# Altium schematic sheet ADC.SchDoc
size Tabloid; DocumentNumber: 6; SheetNumber: 6; SheetTotal: 11; SheetName: ADC
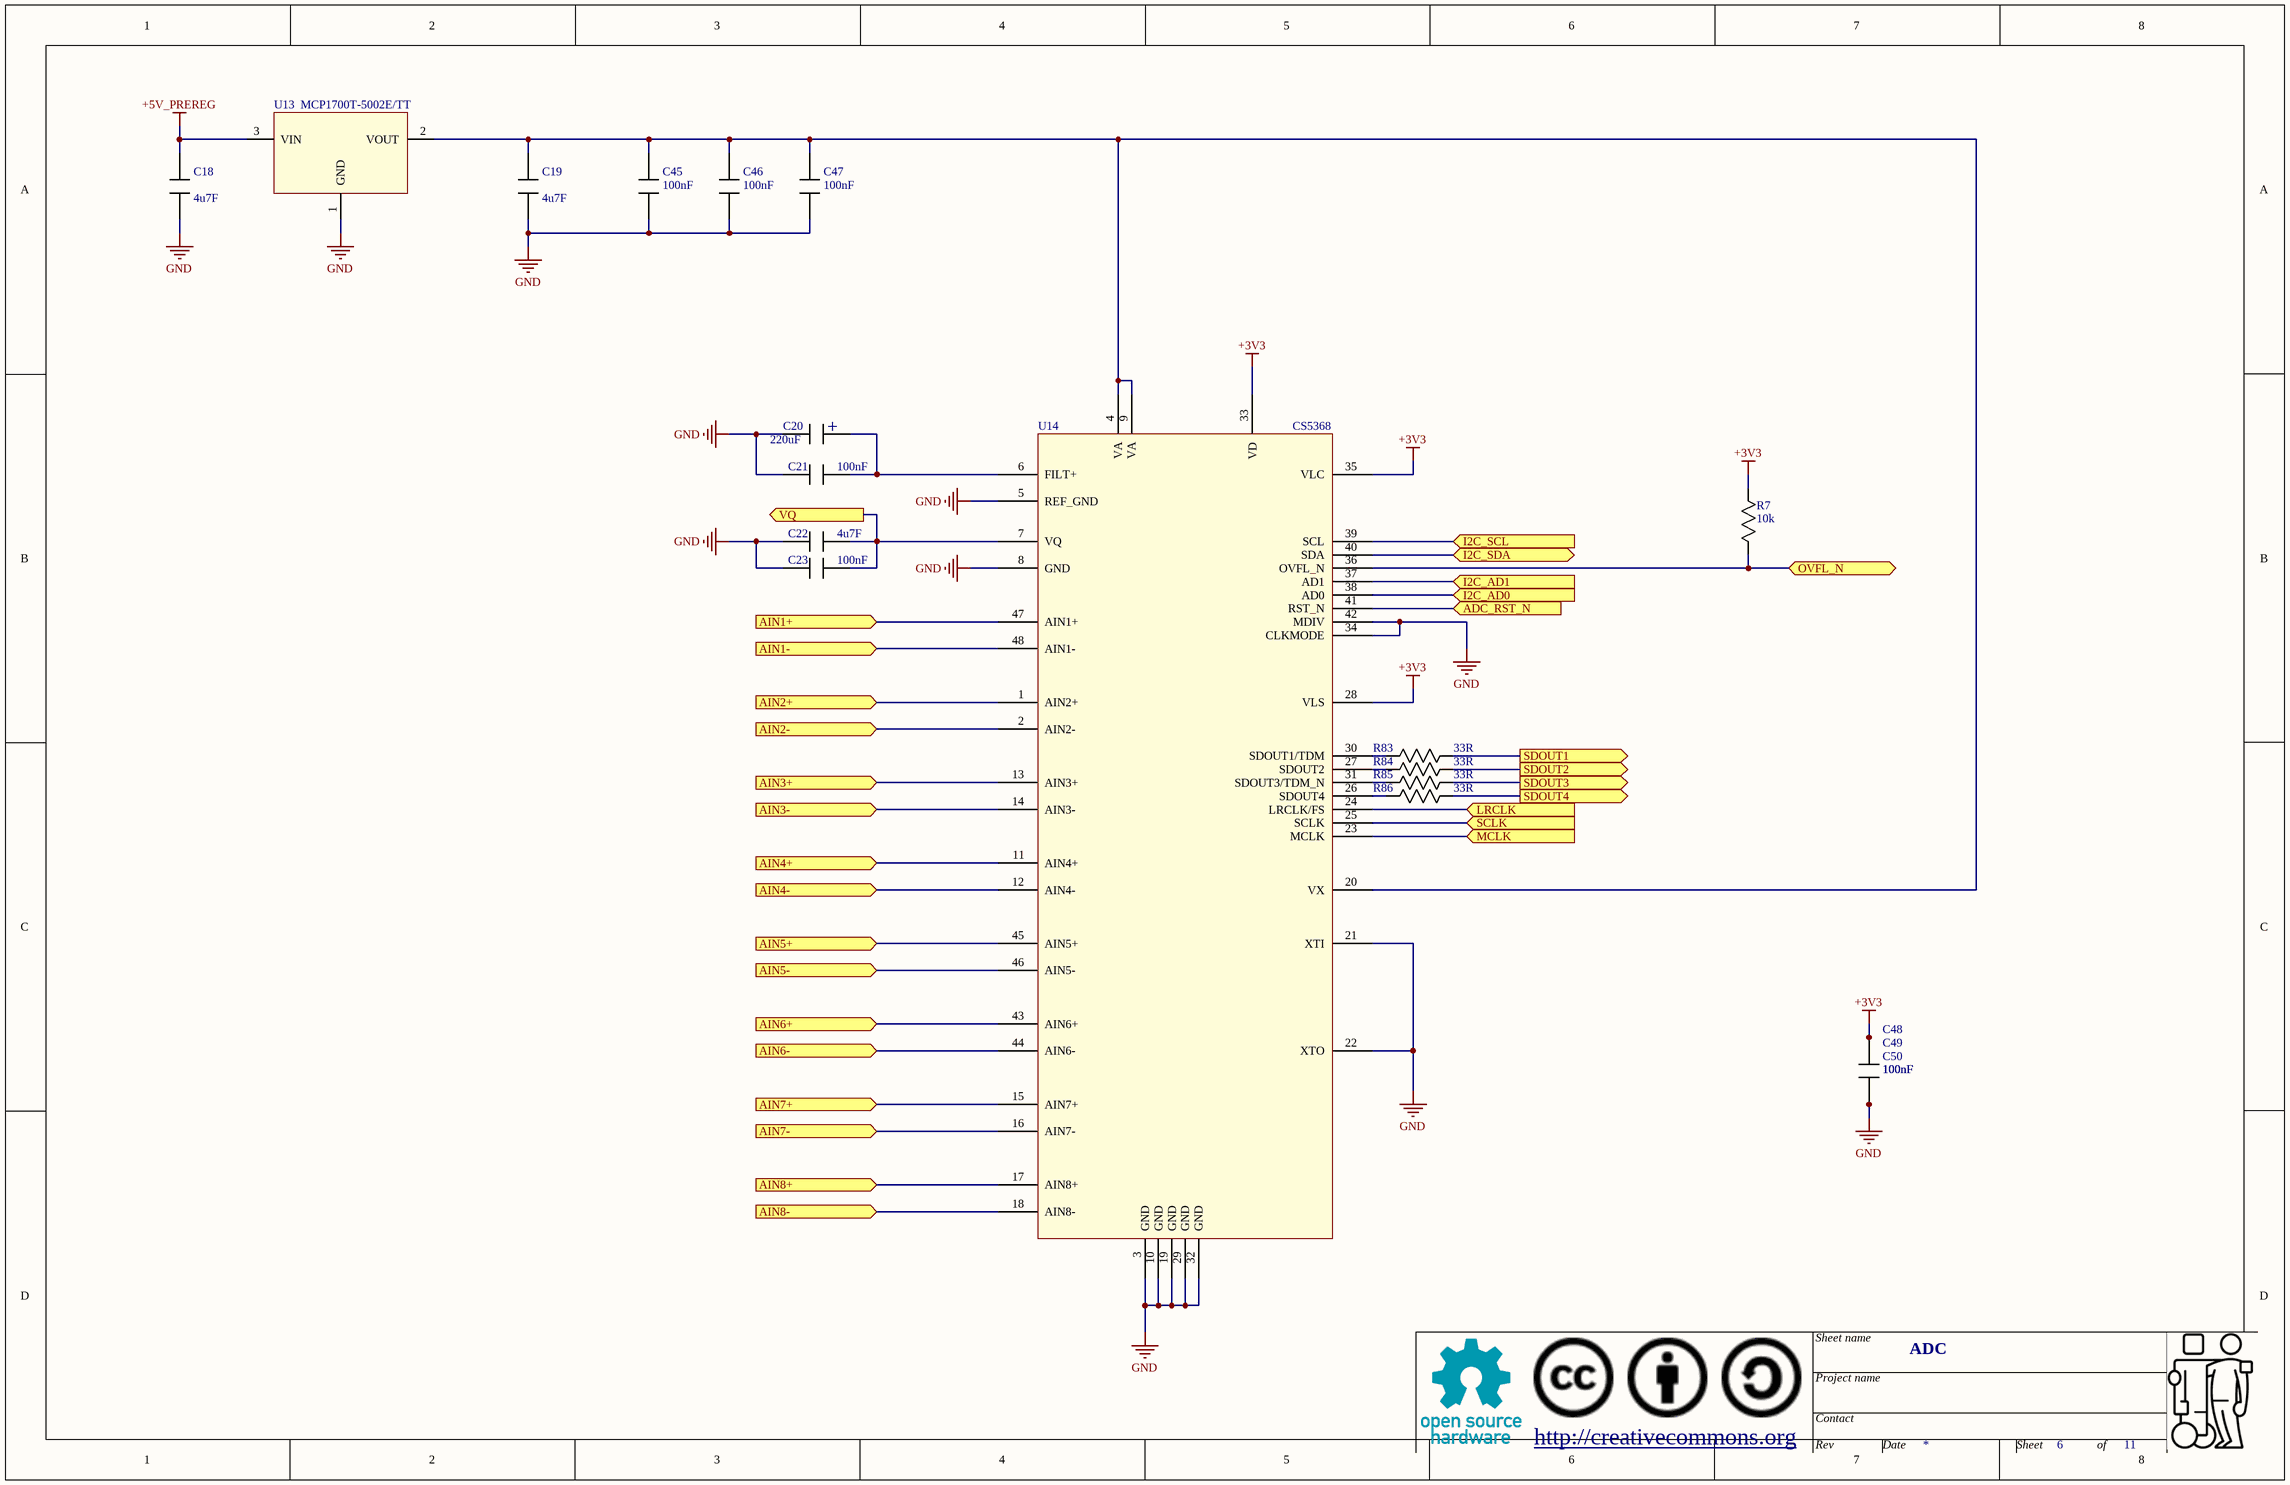
[diagram p0: ADC.SchDoc]

## Parts
C18  value 4u7F  [0805]  (hidden comment: Capacitor)
C19  value 4u7F  [0805]  (hidden comment: Capacitor)
C20  value 220uF  [CAP_RAD_SMD_DIA315]  (hidden comment: Capacitor_Polarized)
C21  value 100nF  [0603]  (hidden comment: Capacitor)
C22  value 4u7F  [0805]  (hidden comment: Capacitor)
C23  value 100nF  [0603]  (hidden comment: Capacitor)
C45  value 100nF  [0603]  (hidden comment: Capacitor)
C46  value 100nF  [0603]  (hidden comment: Capacitor)
C47  value 100nF  [0603]  (hidden comment: Capacitor)
C48  value 100nF  [0603]  (hidden comment: Capacitor)
C49  value 100nF  [0603]  (hidden comment: Capacitor)
C50  value 100nF  [0603]  (hidden comment: Capacitor)
R7  value 10k  [0603]  (hidden comment: Resistor)
R83  value 33R  [0603]  (hidden comment: Resistor)
R84  value 33R  [0603]  (hidden comment: Resistor)
R85  value 33R  [0603]  (hidden comment: Resistor)
R86  value 33R  [0603]  (hidden comment: Resistor)
U13  Mfg_PN: MCP1700T-5002E/TT  [SOT23_132]  (hidden comment: MCP1700)
U14  CS5368  [LQFP_48L_CIRRUS]

## Ports
ADC_RST_N (in), AIN1+ (in), AIN1- (in), AIN2+ (in), AIN2- (in), AIN3+ (in), AIN3- (in), AIN4+ (in), AIN4- (in), AIN5+ (in), AIN5- (in), AIN6+ (in), AIN6- (in), AIN7+ (in), AIN7- (in), AIN8+ (in), AIN8- (in), I2C_AD0 (in), I2C_AD1 (in), I2C_SCL (in), I2C_SDA (bidir), LRCLK (in), MCLK (in), OVFL_N (bidir), SCLK (in), SDOUT1 (out), SDOUT2 (out), SDOUT3 (out), SDOUT4 (out), VQ (out)

## Nets
+3V3: C48.1 C49.1 C50.1 R7.1 U14.28(VLS) U14.33(VD) U14.35(VLC)
+5V_PREREG: C18.1 U13.3(VIN)
GND: C18.2 C19.2 C20.- C21.2 C22.2 C23.2 C45.2 C46.2 C47.2 C48.2 C49.2 C50.2 U13.1(GND) U14.3(GND) U14.5(REF_GND) U14.8(GND) U14.10(GND) U14.19(GND) U14.21(XTI) U14.22(XTO) U14.29(GND) U14.32(GND) U14.34(CLKMODE) U14.42(MDIV)
ADC_RST_N: U14.41(RST_N) ; port ADC_RST_N
AIN1+: U14.47(AIN1+) ; port AIN1+
AIN1-: U14.48(AIN1-) ; port AIN1-
AIN2+: U14.1(AIN2+) ; port AIN2+
AIN2-: U14.2(AIN2-) ; port AIN2-
AIN3+: U14.13(AIN3+) ; port AIN3+
AIN3-: U14.14(AIN3-) ; port AIN3-
AIN4+: U14.11(AIN4+) ; port AIN4+
AIN4-: U14.12(AIN4-) ; port AIN4-
AIN5+: U14.45(AIN5+) ; port AIN5+
AIN5-: U14.46(AIN5-) ; port AIN5-
AIN6+: U14.43(AIN6+) ; port AIN6+
AIN6-: U14.44(AIN6-) ; port AIN6-
AIN7+: U14.15(AIN7+) ; port AIN7+
AIN7-: U14.16(AIN7-) ; port AIN7-
AIN8+: U14.17(AIN8+) ; port AIN8+
AIN8-: U14.18(AIN8-) ; port AIN8-
I2C_AD0: U14.38(AD0) ; port I2C_AD0
I2C_AD1: U14.37(AD1) ; port I2C_AD1
I2C_SCL: U14.39(SCL) ; port I2C_SCL
I2C_SDA: U14.40(SDA) ; port I2C_SDA
LRCLK: U14.24(LRCLK/FS) ; port LRCLK
MCLK: U14.23(MCLK) ; port MCLK
OVFL_N: R7.2 U14.36(OVFL_N) ; port OVFL_N
SCLK: U14.25(SCLK) ; port SCLK
SDOUT1: R83.2 ; port SDOUT1
SDOUT2: R84.2 ; port SDOUT2
SDOUT3: R85.2 ; port SDOUT3
SDOUT4: R86.2 ; port SDOUT4
VQ: C22.1 C23.1 U14.7(VQ) ; port VQ
NetC19_1: C19.1 C45.1 C46.1 C47.1 U13.2(VOUT) U14.4(VA) U14.9(VA) U14.20(VX)
NetC20_+: C20.+ C21.1 U14.6(FILT+)
NetR83_1: R83.1 U14.30(SDOUT1/TDM)
NetR84_1: R84.1 U14.27(SDOUT2)
NetR85_1: R85.1 U14.31(SDOUT3/TDM_N)
NetR86_1: R86.1 U14.26(SDOUT4)

## Notes on the sheet
- Sheet name
- http://creativecommons.org
- Project name
- Contact
- Rev
- Date
- Sheet
- of

## Library data of the parts
C18 C19 C22 = Capacitor: Mfg: Samsung; Mfg_PN: CL21A475KAQNNNG; HelpURL: *; NI: *; Supplier1: Digikey; Supplier1_PN: 1276-6462-1-ND; Tolerance: *; Type: *; Rating: *
C20 = Capacitor_Polarized: Capacitor; Mfg: Nichicon; Mfg_PN: UWT1E221MNL1GS; HelpURL: *; NI: *; Supplier1: Digikey; Supplier1_PN: 493-2192-1-ND; Tolerance: *; Type: *; Rating: *
C21 C23 C45-C50 = Capacitor: Mfg: Samsung; Mfg_PN: CL10F104ZO8NNNC; HelpURL: *; NI: *; Supplier1: Digikey; Supplier1_PN: 1276-1258-1-ND; Tolerance: *; Type: *; Rating: *
R7 = Resistor: Mfg: Yageo; Mfg_PN: RC0603JR-0710KL; HelpURL: *; NI: *; Supplier1: Digikey; Supplier1_PN: 311-10KGRCT-ND; Type: *; Rating: *; Tolerance: *
R83-R86 = Resistor: Mfg: Yageo; Mfg_PN: RC0603JR-0733RL; HelpURL: *; NI: *; Supplier1: Digikey; Supplier1_PN: 311-33GRCT-ND; Type: *; Rating: *; Tolerance: *
U13 = MCP1700: Linear voltage regulator; Mfg: Microchip; HelpURL: http://ww1.microchip.com/downloads/en/DeviceDoc/20001826C.pdf; NI: *; Supplier1: Digikey; Supplier1_PN: MCP1700T5002ETTCT-ND; Type: *
U14 = CS5368: ADC, 24bit, 8 chan, 192kHz, PCM, TDM, LQFP48; Mfg_PN: CS5368-CQZ; Mfg: Cirrus; Supplier1: Digikey; Supplier1_PN: 598-1090-ND